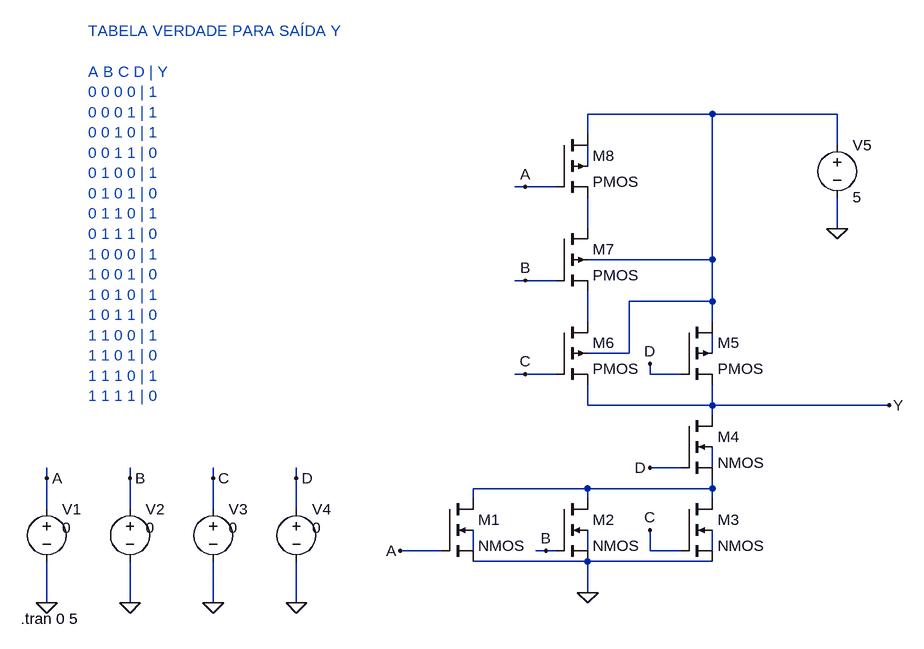
[diagram p0: schematic Draft4.asc]
Draft4.asc, the LTspice schematic file:
Version 4.1
SHEET 1 880 680
WIRE 464 -352 272 -352
WIRE 656 -352 464 -352
WIRE 272 -320 272 -352
WIRE 656 -304 656 -352
WIRE 272 -272 272 -304
WIRE 176 -240 160 -240
WIRE 224 -240 176 -240
WIRE 272 -176 272 -224
WIRE 656 -176 656 -224
WIRE 464 -128 464 -352
WIRE 464 -128 272 -128
WIRE 176 -96 160 -96
WIRE 224 -96 176 -96
WIRE 464 -64 464 -128
WIRE 464 -64 336 -64
WIRE 272 -32 272 -80
WIRE 464 -32 464 -64
WIRE 336 16 336 -64
WIRE 336 16 272 16
WIRE 464 16 464 -16
WIRE 176 48 160 48
WIRE 224 48 176 48
WIRE 368 48 368 32
WIRE 416 48 368 48
WIRE 272 96 272 64
WIRE 464 96 464 64
WIRE 464 96 272 96
WIRE 736 96 464 96
WIRE 464 112 464 96
WIRE 416 192 368 192
WIRE 464 192 464 160
WIRE -560 208 -560 192
WIRE -432 208 -432 192
WIRE -304 208 -304 192
WIRE -176 208 -176 192
WIRE 272 224 96 224
WIRE 464 224 464 208
WIRE 464 224 272 224
WIRE 96 240 96 224
WIRE 272 240 272 224
WIRE 464 240 464 224
WIRE -560 256 -560 208
WIRE -432 256 -432 208
WIRE -304 256 -304 208
WIRE -176 256 -176 208
WIRE 48 320 -16 320
WIRE 96 320 96 288
WIRE 208 320 192 320
WIRE 224 320 208 320
WIRE 272 320 272 288
WIRE 368 320 368 288
WIRE 416 320 368 320
WIRE 464 320 464 288
WIRE 272 336 96 336
WIRE 464 336 272 336
WIRE 272 384 272 336
WIRE -560 400 -560 336
WIRE -432 400 -432 336
WIRE -304 400 -304 336
WIRE -176 400 -176 336
FLAG -560 400 0
FLAG -432 400 0
FLAG -304 400 0
FLAG -176 400 0
FLAG 272 384 0
FLAG 656 -176 0
FLAG -560 208 A
FLAG -16 320 A
FLAG 176 -240 A
FLAG -432 208 B
FLAG 208 320 B
FLAG 176 -96 B
FLAG -304 208 C
FLAG 368 288 C
FLAG 176 48 C
FLAG -176 208 D
FLAG 368 192 D
FLAG 368 32 D
FLAG 736 96 Y
SYMBOL nmos4 48 240 R0
SYMATTR InstName M1
SYMBOL nmos4 224 240 R0
SYMATTR InstName M2
SYMBOL nmos4 416 240 R0
SYMATTR InstName M3
SYMBOL nmos4 416 112 R0
SYMATTR InstName M4
SYMBOL pmos4 416 -32 R0
SYMATTR InstName M5
SYMBOL pmos4 224 -32 R0
SYMATTR InstName M6
SYMBOL pmos4 224 -176 R0
SYMATTR InstName M7
SYMBOL pmos4 224 -320 R0
SYMATTR InstName M8
SYMBOL voltage -560 240 R0
WINDOW 123 0 0 Left 0
WINDOW 39 0 0 Left 0
WINDOW 3 24 44 Left 2
SYMATTR Value 0
SYMATTR InstName V1
SYMBOL voltage -432 240 R0
WINDOW 123 0 0 Left 0
WINDOW 39 0 0 Left 0
WINDOW 3 24 44 Left 2
SYMATTR Value 0
SYMATTR InstName V2
SYMBOL voltage -304 240 R0
WINDOW 123 0 0 Left 0
WINDOW 39 0 0 Left 0
WINDOW 3 24 44 Left 2
SYMATTR Value 0
SYMATTR InstName V3
SYMBOL voltage -176 240 R0
WINDOW 123 0 0 Left 0
WINDOW 39 0 0 Left 0
WINDOW 3 24 44 Left 2
SYMATTR Value 0
SYMATTR InstName V4
SYMBOL voltage 656 -320 R0
WINDOW 123 0 0 Left 0
WINDOW 39 0 0 Left 0
SYMATTR InstName V5
SYMATTR Value 5
TEXT -496 -480 Left 2 ;TABELA VERDADE PARA SAÍDA Y\n \nA B C D | Y\n0 0 0 0 | 1\n0 0 0 1 | 1\n0 0 1 0 | 1\n0 0 1 1 | 0\n0 1 0 0 | 1\n0 1 0 1 | 0\n0 1 1 0 | 1\n0 1 1 1 | 0\n1 0 0 0 | 1\n1 0 0 1 | 0\n1 0 1 0 | 1\n1 0 1 1 | 0\n1 1 0 0 | 1\n1 1 0 1 | 0\n1 1 1 0 | 1\n1 1 1 1 | 0
TEXT -600 424 Left 2 !.tran 0 5

The netlist it stands for:
* Draft4.asc
M1 N007 A 0 N008 NMOS
M2 N007 B 0 N009 NMOS
M3 N007 C 0 N010 NMOS
M4 Y D N007 N006 NMOS
M5 N001 D Y N005 PMOS
M6 N004 C Y N001 PMOS
M7 N003 B N004 N001 PMOS
M8 N001 A N003 N002 PMOS
V1 A 0 0
V2 B 0 0
V3 C 0 0
V4 D 0 0
V5 N001 0 5
.model NMOS NMOS
.model PMOS PMOS
.lib standard.mos
* TABELA VERDADE PARA SAÍDA Y
* A B C D | Y
* 0 0 0 0 | 1
* 0 0 0 1 | 1
* 0 0 1 0 | 1
* 0 0 1 1 | 0
* 0 1 0 0 | 1
* 0 1 0 1 | 0
* 0 1 1 0 | 1
* 0 1 1 1 | 0
* 1 0 0 0 | 1
* 1 0 0 1 | 0
* 1 0 1 0 | 1
* 1 0 1 1 | 0
* 1 1 0 0 | 1
* 1 1 0 1 | 0
* 1 1 1 0 | 1
* 1 1 1 1 | 0
.tran 0 5
.backanno
.end